# Altium schematic sheet Buzzer.SchDoc: Buzzer
size A4; SheetNumber: 7; SheetTotal: 9
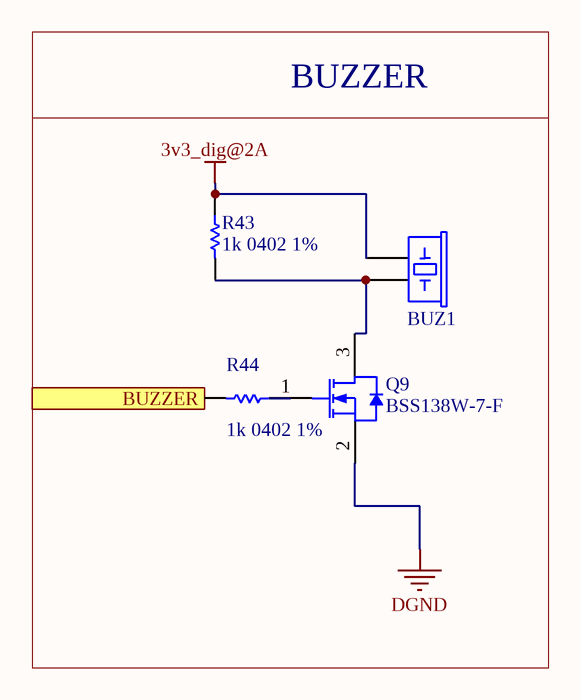
[diagram p0: Buzzer.SchDoc]

## Parts
BUZ1  CUI CMT-1285C-035  [BUZZER-12MM-NS]  (value not drawn)
Q9  BSS138W-7-F  [DIOD-SOT323-3_V]
R43  1k 0402 1%  [RESC1005X40X25ML05T10]
R44  1k 0402 1%  [RESC1005X40X25ML05T10]

## Blocks framed on the sheet
BUZZER: BUZ1 Q9 R43 R44

## Ports
BUZZER (in)

## Nets
3v3_dig@2A: BUZ1.1(+) R43.1
DGND: Q9.2(S)
BUZZER: R44.2 ; port BUZZER
NetBUZ1_2: BUZ1.2(-) Q9.3(D) R43.2
NetQ9_1: Q9.1(G) R44.1

## Notes on the sheet
- Title
- Size:
- Date:
- A3
- Author:
- Time:
- Revision:
- Sheet
- of
- File:

## Library data of the parts
BUZ1 = CMP-581a9557be5887dd-1: Audio Buzzer Magnetic 3Vo-p 5Vo-p 70mA 3.5Vo-p 85dB Through Hole Pin Tray; Lead-Free Status: Lead Free; Octopart URL: https://octopart.com/cmt-1285c-035-cui-71811876; Manufacturer Part Number: CMT-1285C-035; Mounting Style: Through Hole; RoHS: Compliant; OctopartID: 581a9557be5887dd; Manufacturer Part Number 2: GMC1205YA-16R2048; LCSC_PN: C252915
Q9 = CMP-2000-05968-1: N-Channel Enhancement Mode Mosfet, 50 V, 200 mA, -55 to 150 degC, 6-Pin SOT-323, RoHS, Tape and Reel; Typical Turn-Off Delay Time: 20ns; Number of Channels: 1Channel; Type: EnhancementModeFieldEffectTransistor; Brand: DiodesIncorporated; Vds - Drain-Source Breakdown Voltage: 75V; Vgs - Gate-Source Voltage: 20V; Rds On - Drain-Source Resistance: 1.4Ohms; Transistor Type: 1N-Channel; Configuration: Single; Unit Weight: 0.000212oz; Pd - Power Dissipation: 200mW; Id - Continuous Drain Current: 200mA; Forward Transconductance - Min: 0.1S; Manufacturer URL: http://www.diodes.com/; Series: BSS138; Package Description: 3-Pin Small Outline Transistor, Body 2 x 1.25 mm, Pitch 0.65 mm; Mounting Technology: SurfaceMount; Product Category: MOSFET; RoHS: True; Maximum Operating Temperature: +150C; Height: 1mm; Length: 2.2mm; Technology: Si; Width: 1.35mm; Datasheet URL: http://www.diodes.com/_files/datasheets/ds30206.pdf; Manufacturer: DiodesIncorporated; Package / Case: SOT-323-3; Typical Turn-On Delay Time: 20ns; Transistor Polarity: N-Channel; Factory Pack Quantity: 3000; Packaging: Reel; Product: MOSFETSmallSignal; Datasheet Version: Rev. 11-2, 09/2013; Package Reference: SOT323; Minimum Operating Temperature: -55C; Mounting Style: SMD/SMT; Channel Mode: Enhancement; LCSC_PN: C24553
R43 R44 = CMP-2002-07472-1: LCSC_PN: C106235